# EAGLE schematic ControlModule (EAGLE 7.2.0)
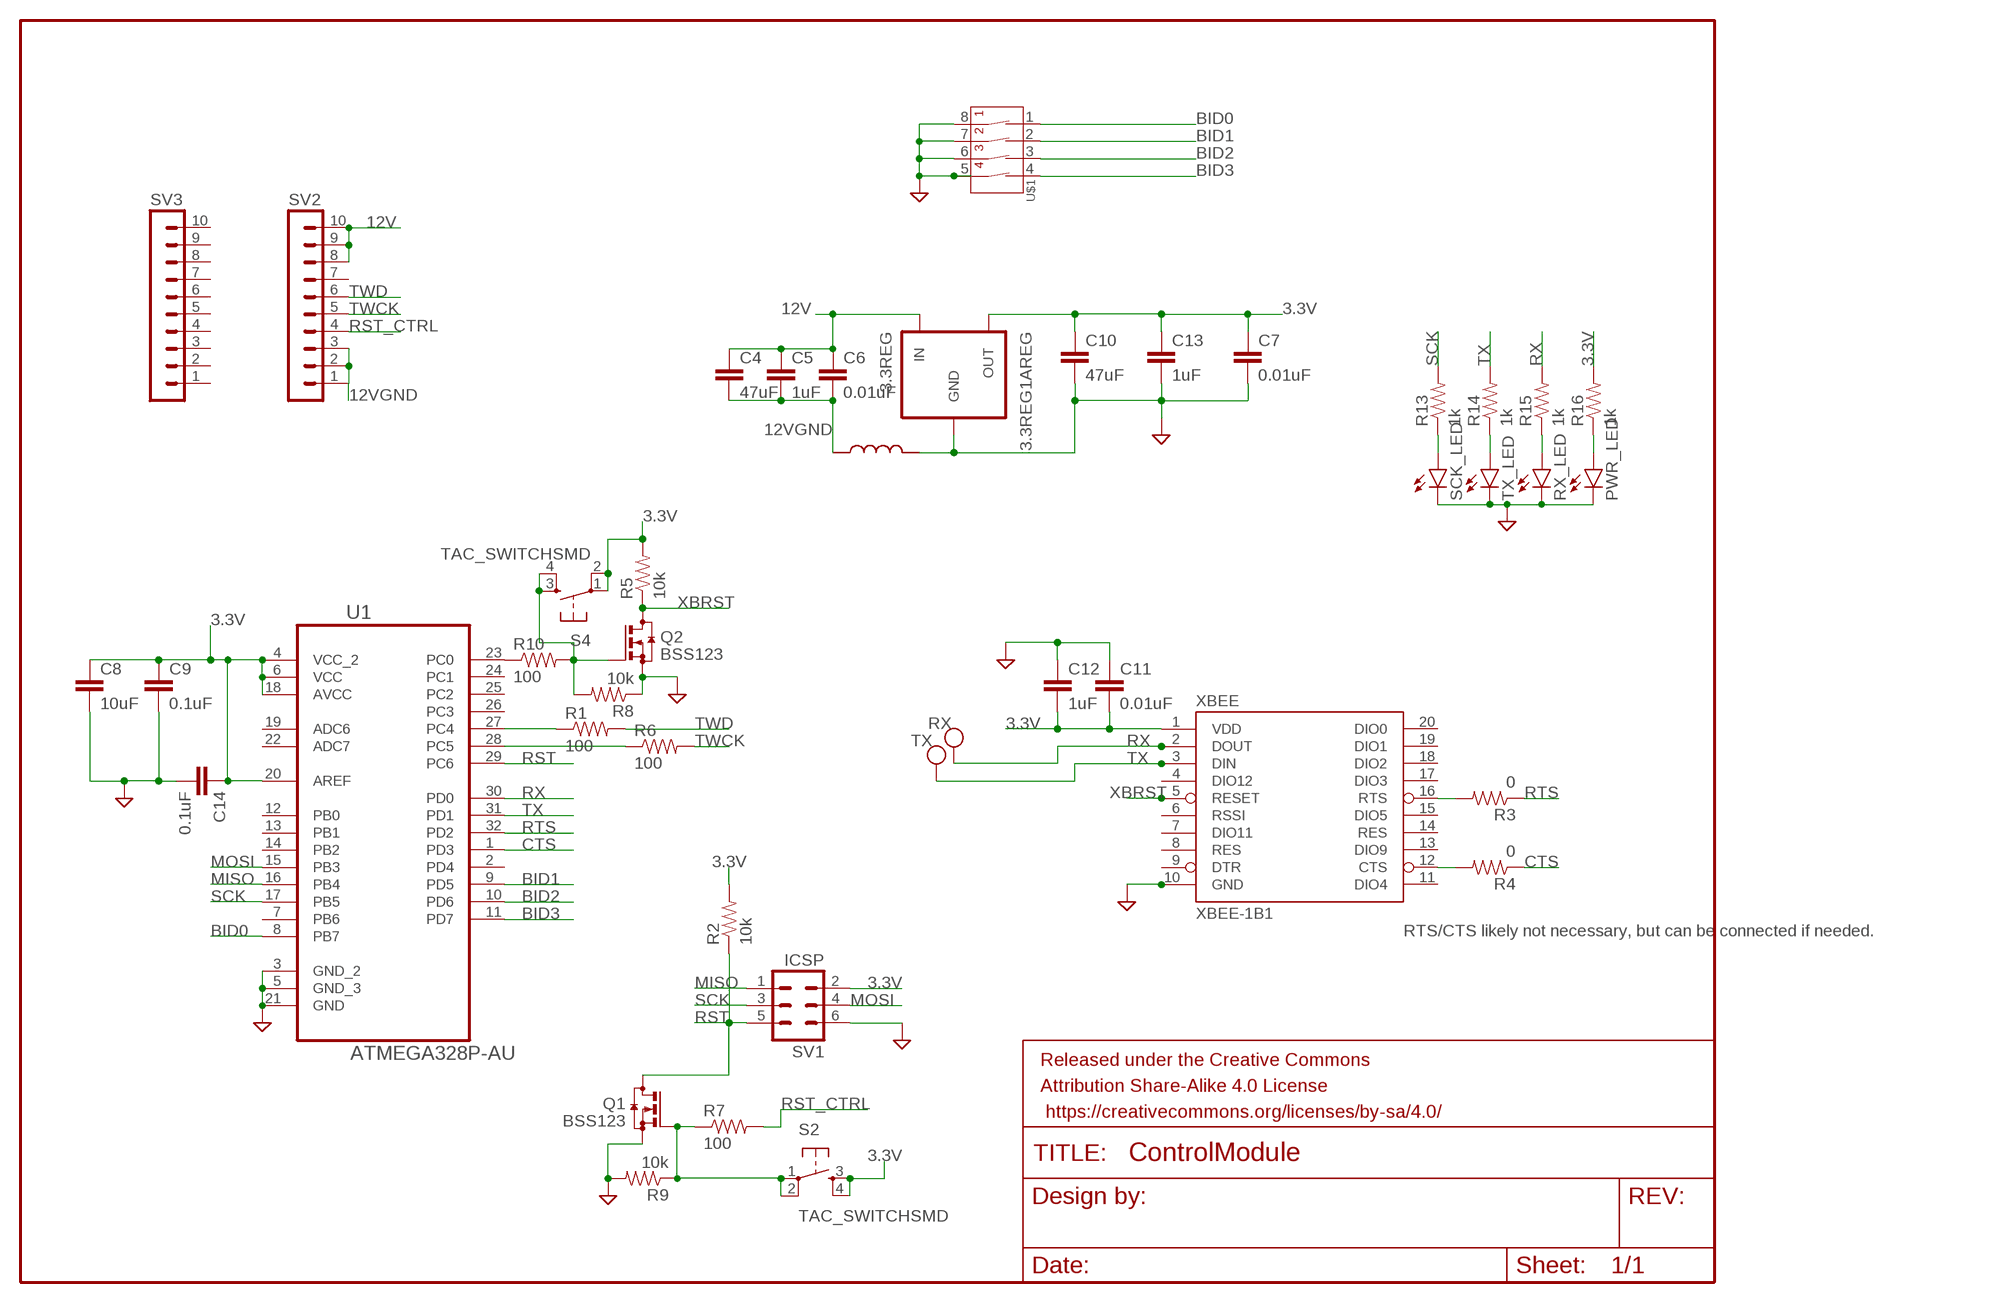
[diagram p0: schematic, sheet 1]

## Parts
3.3REG  3.3REG1AREG  [DPAK]
C4  47uF  CAP1206  [1206]
C5  1uF  CAP0805  [0805]
C6  0.01uF  CAP0805  [0805]
C7  0.01uF  CAP0805  [0805]
C8  10uF  CAP0805  [0805]
C9  0.1uF  CAP0805  [0805]
C10  47uF  CAP1206  [1206]
C11  0.01uF  CAP0805  [0805]
C12  1uF  CAP0805  [0805]
C13  1uF  CAP0805  [0805]
C14  0.1uF  CAP0805  [0805]
FRAME1  FRAME-LETTER  [CREATIVE_COMMONS]
PWR_LED  LED1206  [LED-1206]
Q1  BSS123  [SOT23]
Q2  BSS123  [SOT23]
R1  100  RESISTOR0805-RES  [0805]
R2  10k  RESISTOR0805-RES  [0805]
R3  0  RESISTOR0805-RES  [0805]
R4  0  RESISTOR0805-RES  [0805]
R5  10k  RESISTOR0805-RES  [0805]
R6  100  RESISTOR0805-RES  [0805]
R7  100  RESISTOR0805-RES  [0805]
R8  10k  RESISTOR0805-RES  [0805]
R9  10k  RESISTOR0805-RES  [0805]
R10  100  RESISTOR0805-RES  [0805]
R13  1k  RESISTOR0805-RES  [0805]
R14  1k  RESISTOR0805-RES  [0805]
R15  1k  RESISTOR0805-RES  [0805]
R16  1k  RESISTOR0805-RES  [0805]
RX  TEST_PT  [TESTING_PT]
RX_LED  LED1206  [LED-1206]
S2  TAC_SWITCHSMD  [TACTILE-SWITCH-SMD]
S4  TAC_SWITCHSMD  [TACTILE-SWITCH-SMD]
SCK_LED  LED1206  [LED-1206]
SV1  ICSP  MA03-2  [MA03-2]
SV2  MA10-1W  [MA10-1W]
SV3  MA10-1W  [MA10-1W]
TX  TEST_PT  [TESTING_PT]
TX_LED  LED1206  [LED-1206]
U1  ATMEGA328P-AU  [QFP80P900X900X120-32N]
U$1  4-POS-DIP  [4-POS-DIP-SMD]
U$2  INDUCTOR  [0805]
XBEE  XBEE-1B1  [XBEE-1]

## Nets
3.3V: 3.3REG.SOURCE(OUT) C7.1 C8.1 C9.1 C10.1 C11.2 C12.2 C13.1 C14.1 R2.2 R5.2 R16.2 S2.3 S2.4 S4.1 S4.2 SV1.2 U1.4(VCC_2) U1.6(VCC) U1.18(AVCC) U1.20(AREF) XBEE.1(VDD)
12V: 3.3REG.GATE(IN) C4.1 C5.1 C6.1 SV2.8 SV2.9 SV2.10
12VGND: C4.2 C5.2 C6.2 SV2.1 SV2.2 SV2.3 U$2.1
BID0: U1.8(PB7) U$1.1(1A)
BID1: U1.9(PD5) U$1.2(2A)
BID2: U1.10(PD6) U$1.3(3A)
BID3: U1.11(PD7) U$1.4(4A)
CTS: R4.1 U1.1(PD3)
GND: 3.3REG.DRAIN(GND) C7.2 C8.2 C9.2 C10.2 C11.1 C12.1 C13.2 C14.2 PWR_LED.C Q1.2(S) Q2.2(S) R8.1 R9.2 RX_LED.C SCK_LED.C SV1.6 TX_LED.C U1.3(GND_2) U1.5(GND_3) U1.21(GND) U$1.5(4B) U$1.6(3B) U$1.7(2B) U$1.8(1B) U$2.2 XBEE.10(GND)
MISO: SV1.1 U1.16(PB4)
MOSI: SV1.4 U1.15(PB3)
N$1: R3.2 XBEE.16(RTS)
N$2: R13.1 SCK_LED.A
N$3: R4.2 XBEE.12(CTS)
N$5: R1.1 U1.27(PC4)
N$7: R10.1 U1.23(PC0)
N$8: R6.1 U1.28(PC5)
N$9: R14.1 TX_LED.A
N$10: R15.1 RX_LED.A
N$11: PWR_LED.A R16.1
N$12: Q2.1(G) R8.2 R10.2 S4.3 S4.4
N$13: Q1.1(G) R7.1 R9.1 S2.1 S2.2
RST: Q1.3(D) R2.1 SV1.5 U1.29(PC6)
RST_CTRL: R7.2 SV2.4
RTS: R3.1 U1.32(PD2)
RX: R15.2 RX.P$1 U1.30(PD0) XBEE.2(DOUT)
SCK: R13.2 SV1.3 U1.17(PB5)
TWCK: R6.2 SV2.5
TWD: R1.2 SV2.6
TX: R14.2 TX.P$1 U1.31(PD1) XBEE.3(DIN)
XBRST: Q2.3(D) R5.1 XBEE.5(RESET)
Unconnected: SV2.7 SV3.1 SV3.2 SV3.3 SV3.4 SV3.5 SV3.6 SV3.7 SV3.8 SV3.9 SV3.10 U1.2(PD4) U1.7(PB6) U1.12(PB0) U1.13(PB1) U1.14(PB2) U1.19(ADC6) U1.22(ADC7) U1.24(PC1) U1.25(PC2) U1.26(PC3) XBEE.4(DIO12) XBEE.6(RSSI) XBEE.7(DIO11) XBEE.8(RES) XBEE.9(DTR) XBEE.11(DIO4) XBEE.13(DIO9) XBEE.14(RES) XBEE.15(DIO5) XBEE.17(DIO3) XBEE.18(DIO2) XBEE.19(DIO1) XBEE.20(DIO0)

## Notes on the sheet
- RTS/CTS likely not necessary, but can be connected if needed.

## Library data of the parts
3.3REG = gen3:3.3REG1A
C4-C14 = SparkFun-Capacitors:CAP: Capacitor Standard 0603 ceramic capacitor, and 0.1" leaded capacitor.
FRAME1 = SparkFun-Aesthetics:FRAME-LETTER: Schematic Frame Standard 8.5x11 US Letter frame
PWR_LED RX_LED SCK_LED TX_LED = SparkFun-LED:LED: LEDs Standard schematic elements and footprints for 5mm, 3mm, 1206, and 0603 sized LEDs. 5mm - Spark Fun Electronics SKU : COM-00529 (and others)
Q1 Q2 = transistor-small-signal:BSS123: N-CHANNEL MOS FET
R1-R10 R13-R16 = SparkFun-Passives:RESISTOR: Resistor Basic schematic elements and footprints for 0603, 1206, and PTH resistors.
RX TX = gen3:TEST_PT: Testing Point Use to probe a signal
S2 S4 = SparkFun-Retired:TAC_SWITCH: Momentary Switch Button commonly used for reset or general input. Spark Fun Electronics SKU : COM-00097 SMT- SWCH-08247; PROD_ID: SWCH-08247
SV1 = con-lstb:MA03-2: PIN HEADER; OC_FARNELL: unknown; OC_NEWARK: unknown
SV2 SV3 = con-lstb:MA10-1W: PIN HEADER; OC_FARNELL: unknown; OC_NEWARK: unknown
U1 = Atmel_By_element14_Batch_1-00:ATMEGA328P-AU: 8-bit Microcontroller with In-System Programmable Flash; MPN: ATMEGA328P-AU; OC_FARNELL: 1715486; OC_NEWARK: 14R4631; PACKAGE: TQFP-32; SUPPLIER: Atmel
U$1 = SparkFun-Electromechanical:4-POS-DIP: 4 Position DIP Switch CTS series 219; PROD_ID: SWCH-12418
U$2 = gen3:INDUCTOR
XBEE = SparkFun-RF:XBEE-1: Xbee module footprints SMT header is CONN-09042.